# EAGLE schematic LM2578 (EAGLE 6.2)
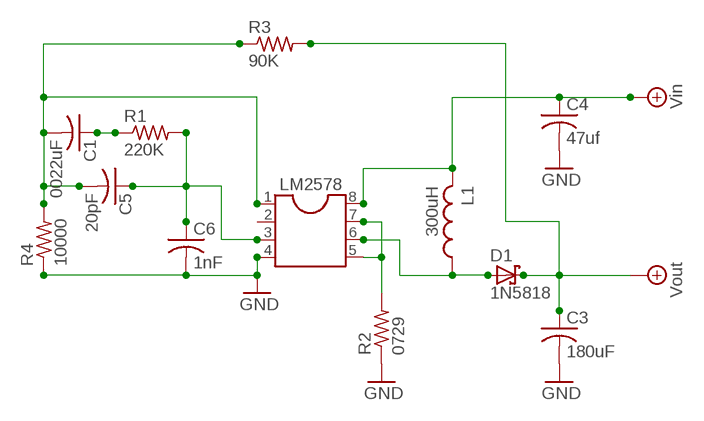
[diagram p0: schematic, sheet 1]

## Parts
C1  0022uF  C-US050-025X075  [C050-025X075]
C3  180uF  C-US050-025X075  [C050-025X075]
C4  47uf  C-US050-025X075  [C050-025X075]
C5  20pF  C-US050-025X075  [C050-025X075]
C6  1nF  C-US050-025X075  [C050-025X075]
D1  1N5818  1N5908  [C4111-15]
L1  300uH  L-USL1812  [L1812]
LM2578  DIL8  [DIL08]
R1  220K  R-US_0414/15  [0414/15]
R2  0729  R-US_0414/15  [0414/15]
R3  90K  R-US_0414/15  [0414/15]
R4  10000  R-US_0414/15  [0414/15]

## Nets
+7V: C3.1 D1.C R3.2 ; supply symbol labelled Vout
GND: C3.2 C4.2 LM2578.4 R2.1
N$1: C1.1 R1.1
N$2: C5.1 C6.1 LM2578.3 R1.2
N$3: C1.2 C5.2 LM2578.1 R3.1 R4.2
N$4: C6.2 R4.1
N$5: LM2578.5 LM2578.7 R2.2
N$8: C4.1 L1.2 LM2578.8 ; supply symbol labelled Vin
N$10: D1.A L1.1 LM2578.6
Unconnected: LM2578.2

## Library data of the parts
C1 C3-C6 = resistor:C-US: CAPACITOR, American symbol
D1 = diode:1N5908: DIODE schottky
L1 = resistor:L-US: INDUCTOR, American symbol
LM2578 = ic-package:DIL8: Dual In Line / Socket
R1-R4 = resistor:R-US_: RESISTOR, American symbol